# EAGLE schematic Teensy + MD (EAGLE 9.6.1)
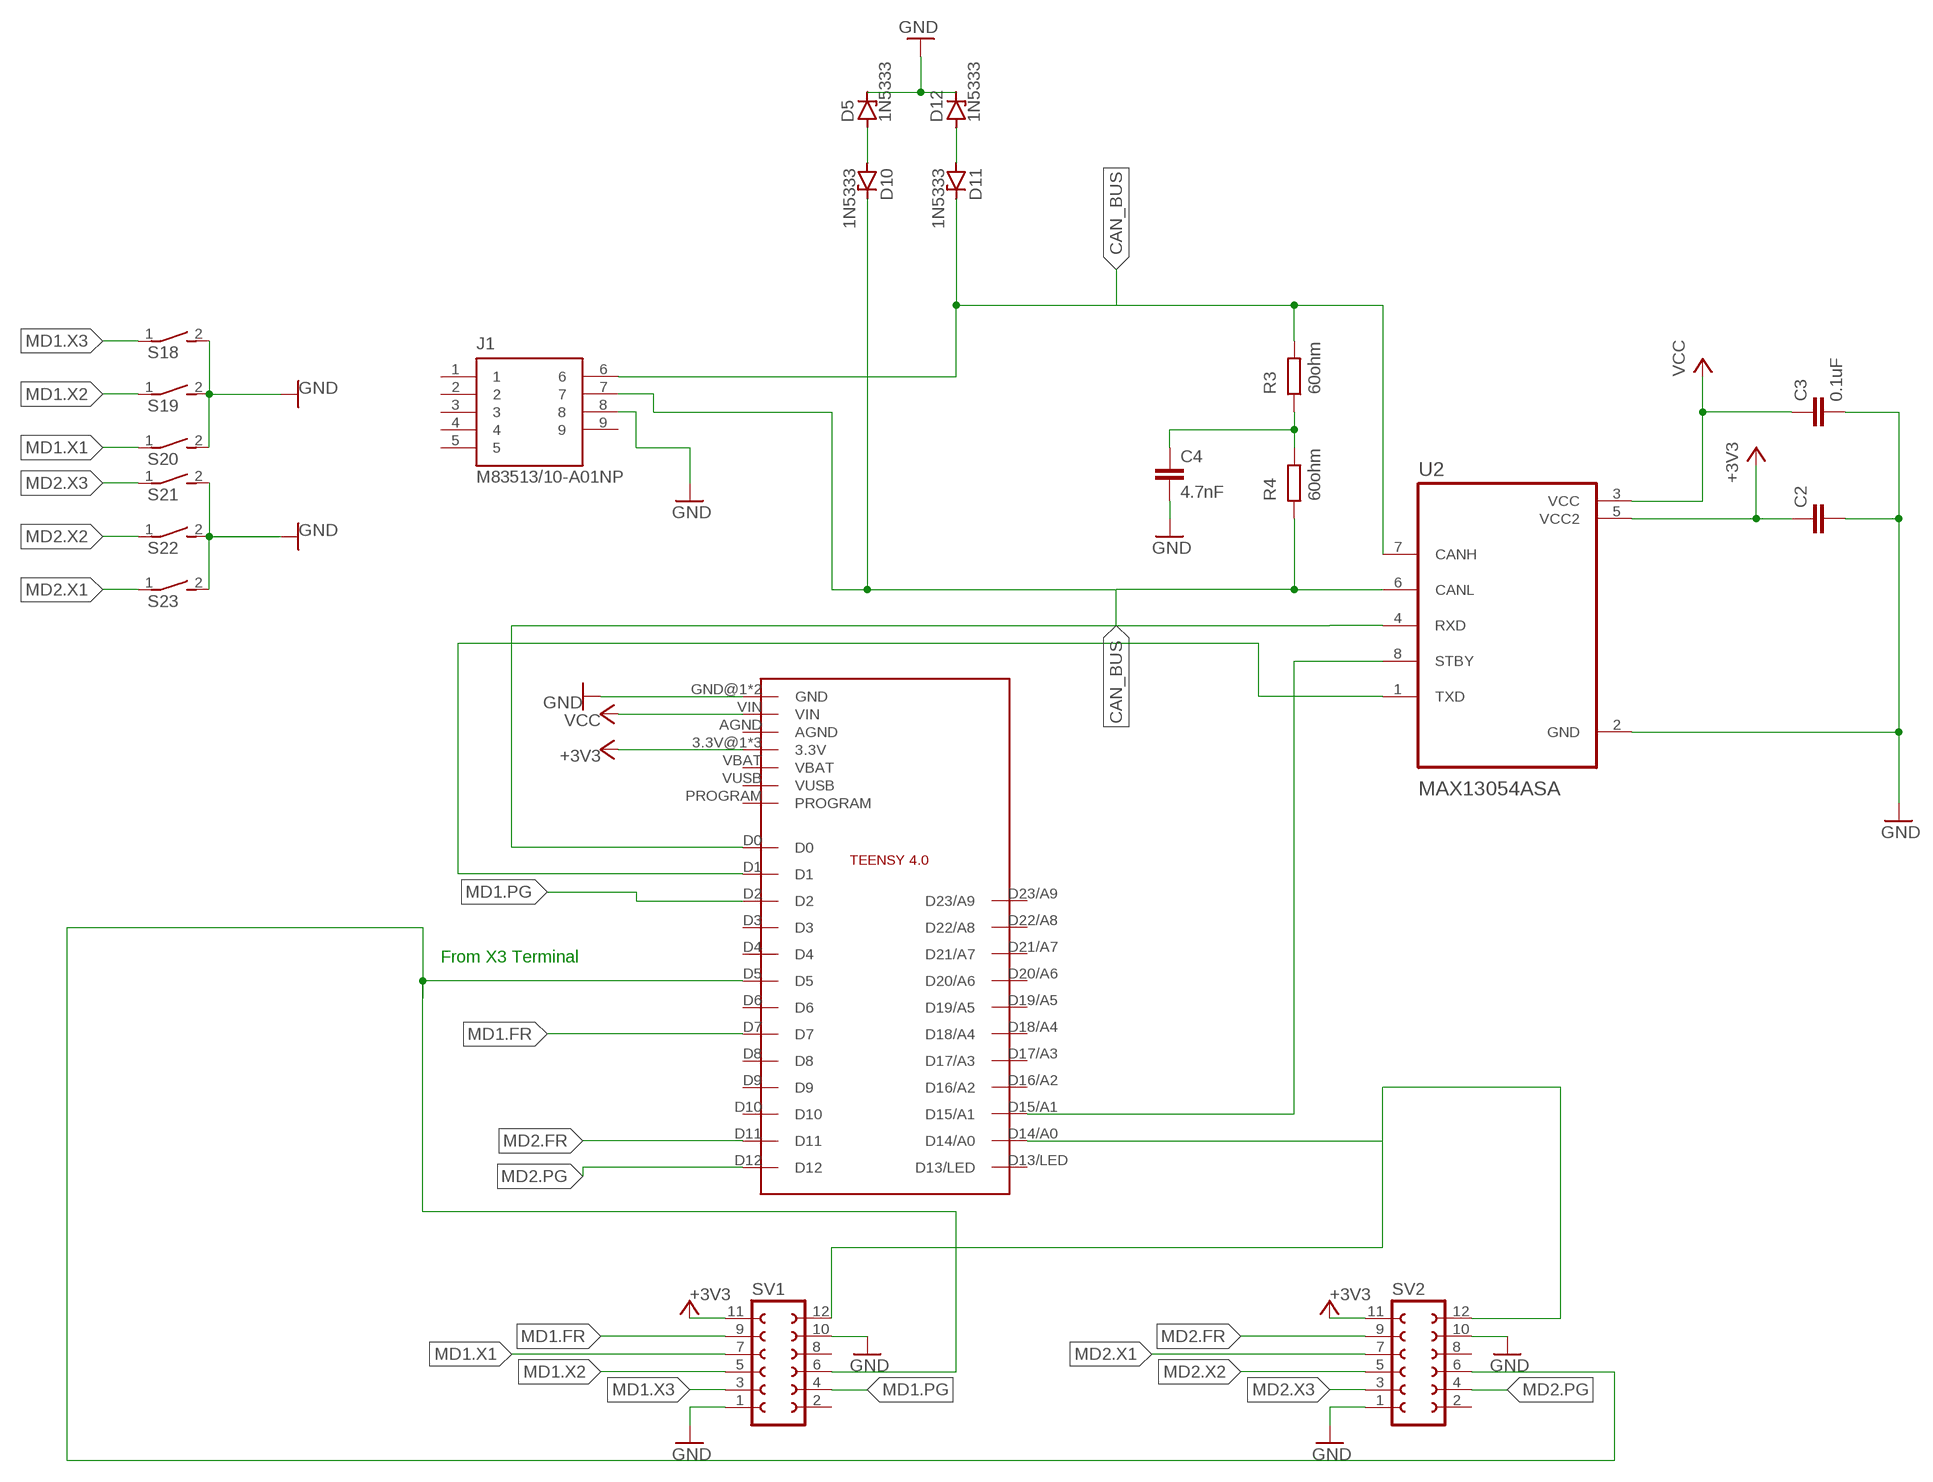
[diagram p0: schematic, sheet 1]

## Parts
C2  C2,5-3  [C2.5-3]
C3  0.1uF  C2,5-3  [C2.5-3]
C4  4.7nF  C2,5-3  [C2.5-3]
D5  1N5333  [C1702-15]
D10  1N5333  [C1702-15]
D11  1N5333  [C1702-15]
D12  1N5333  [C1702-15]
J1  M83513/10-A01NP  [BEL_M83513/10-A01NP]
R3  60ohm  R  (no package)
R4  60ohm  R  (no package)
S18  DS01E  [DS-01]
S19  DS01E  [DS-01]
S20  DS01E  [DS-01]
S21  DS01E  [DS-01]
S22  DS01E  [DS-01]
S23  DS01E  [DS-01]
SV1  FE06-2  [FE06-2]
SV2  FE06-2  [FE06-2]
U2  MAX13054ASA  [SOIC127P600X175-8N]
U$3  TEENSY4.0  [TEENSY4.0]

## Nets
+3V3: C2.1 SV1.11 SV2.11 U2.5(VCC2) U$3.3.3V@1(3.3V) U$3.3.3V@2(3.3V) U$3.ON/OFF(3.3V)
CAN_BUS: D11.C J1.6 R3.2 U2.7(CANH)
GND: C2.2 C3.2 C4.2 D5.C D12.C J1.8 S18.2 S19.2 S20.2 S21.2 S22.2 S23.2 SV1.1 SV1.10 SV2.1 SV2.10 U2.2(GND) U$3.GND@1(GND) U$3.GND@2(GND)
MD1.5V: SV1.6 SV2.6 U$3.D5
MD1.FR: SV1.9 U$3.D7
MD1.PG: SV1.4 U$3.D2
MD1.X1: S20.1 SV1.7
MD1.X2: S19.1 SV1.5
MD1.X3: S18.1 SV1.3
MD2.BK: SV1.12 SV2.12 U$3.D14/A0
MD2.FR: SV2.9 U$3.D11
MD2.PG: SV2.4 U$3.D12
MD2.X1: S23.1 SV2.7
MD2.X2: S22.1 SV2.5
MD2.X3: S21.1 SV2.3
N$9: D10.C J1.7 R4.1 U2.6(CANL)
N$10: U2.8(STBY) U$3.D15/A1
N$11: U2.4(RXD) U$3.D0
N$12: U2.1(TXD) U$3.D1
N$13: C4.1 R3.1 R4.2
N$14: D5.A D10.A
N$15: D11.A D12.A
VCC: C3.1 U2.3(VCC) U$3.VIN
Unconnected: J1.1 J1.2 J1.3 J1.4 J1.5 J1.9 SV1.2 SV1.8 SV2.2 SV2.8 U$3.AGND U$3.D3 U$3.D4 U$3.D6 U$3.D8 U$3.D9 U$3.D10 U$3.D13/LED U$3.D16/A2 U$3.D17/A3 U$3.D18/A4 U$3.D19/A5 U$3.D20/A6 U$3.D21/A7 U$3.D22/A8 U$3.D23/A9 U$3.PROGRAM U$3.VBAT U$3.VUSB

## Notes on the sheet
- From X3 Terminal

## Library data of the parts
C2-C4 = capacitor-wima:C: CAPACITOR naming: grid - package width
D5 D10-D12 = diode:1N5333: Z DIODE 3.3 V, 5W, 5 percent (Motorola)
J1 = M83513_10-A01NP:M83513/10-A01NP: MIL-DTL-83513 PCB Mounted Connector | Plug | 9 Positions | Shell Finish - Cadmium | Male | PCB Solder Pins | 0.109in (2.77 mm) Pin Length; AVAILABILITY: Unavailable; DESCRIPTION: MIL-DTL-83513 PCB Mounted Connector | Plug | 9 Positions | Shell Finish - Nickel | Male | PCB Solder Pins | 0.109 (2.77 mm) Pin Length | Jackpost Attached; MF: Cinch Connectivity Solutions; MP: M83513/10-A01NP; PACKAGE: None; PRICE: None
R3 R4 = ngspice-simulation:R: RESISTOR
S18-S23 = switch-dil:DS01E: DIL/CODE SWITCH; OC_FARNELL: unknown; OC_NEWARK: unknown
SV1 SV2 = con-lsta:FE06-2: FEMALE HEADER; OC_FARNELL: unknown; OC_NEWARK: unknown
U2 = MAX13054ASA:MAX13054ASA; DESCRIPTION: 1/1 Transceiver Full CANbus 8-SOIC; DIGI-KEY_PART_NUMBER: MAX13054ASA+TTR-ND; DIGI-KEY_PURCHASE_URL: https://www.digikey.com/product-detail/en/maxim-integrated/MAX13054ASA-T/MAX13054ASA-TTR-ND/1475460?utm_source=snapeda&utm_medium=aggregator&utm_campaign=symbol; MF: Maxim Integrated; MP: MAX13054ASA+; PACKAGE: SOIC-8 Maxim
U$3 = Teensy4.0:TEENSY4.0

## Module RESISTER
Ports: 

### Library data of the parts

## Module GND
Ports: 

### Library data of the parts

## Module MOTOR
Ports: 

### Library data of the parts

## Module MOTORDRIVER
Ports: U(io) V(io) W(io) VCC(io) GND(io) 5V(io) GND1(io) HA(io) HB(io) HC(io) RS232(io) PWR(io) ALM(io) GND2(io) ALM1(io) X3(io) PG(io) X2(io) 5V1(io) X1(io) 5V2(io) PR(io) GND3(io) EN(io) BR(io)

### Library data of the parts

## Net classes
0 default: width 0.305 mm, drill 0.508 mm, clearance 0.254 mm